# EAGLE design uBridge1.1 (EAGLE 6.6.0)
Assembly variants: PTH_60Vdc, PTH_36Vdc
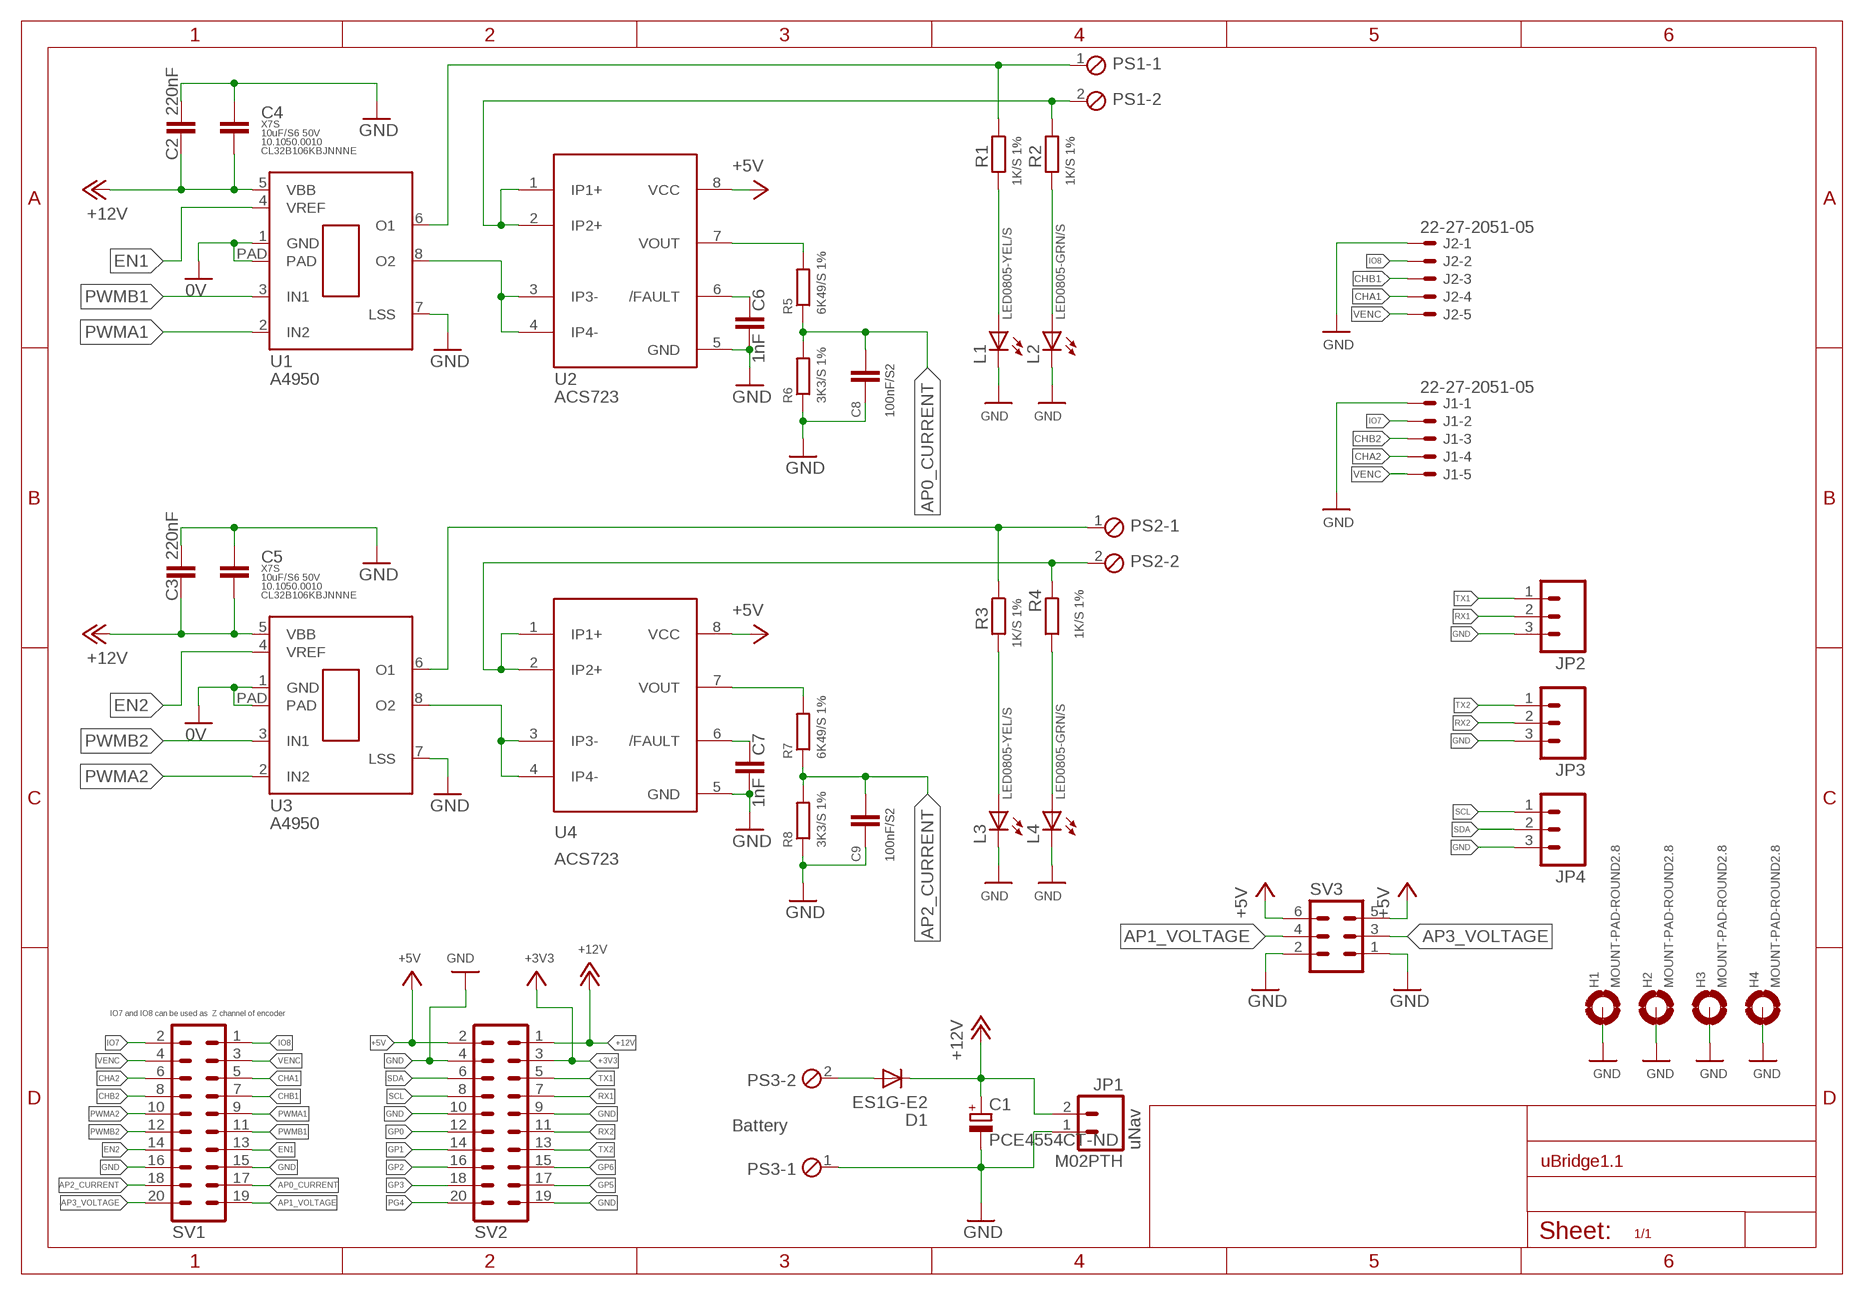
[diagram p0: schematic, sheet 1]

## Parts
C1  PCE4554CT-ND  CPOL-EUUD-6,3X7,7  [UD-6,3X7,7_NICHICON]
C2  220nF  C-EUC0805K  [C0805K]
C3  220nF  C-EUC0805K  [C0805K]
C4  10uF/S6 50V  C-EUC3225  [C3225]
C5  10uF/S6 50V  C-EUC3225  [C3225]
C6  1nF  C-EUC0805K  [C0805K]
C7  1nF  C-EUC0805K  [C0805K]
C8  100nF/S2  C-EUC0603  [C0603]
C9  100nF/S2  C-EUC0603  [C0603]
D1  ES1G-E2  DIODE-DO214BA  [DO214BA]  (not fitted in variant PTH_60Vdc)  (not fitted in variant PTH_36Vdc)
H1  MOUNT-PAD-ROUND2.8  [2,8-PAD]
H2  MOUNT-PAD-ROUND2.8  [2,8-PAD]
H3  MOUNT-PAD-ROUND2.8  [2,8-PAD]
H4  MOUNT-PAD-ROUND2.8  [2,8-PAD]
J1  22-27-2051-05  [6410-05]
J2  22-27-2051-05  [6410-05]
JP1  M02PTH  [1X02]
JP2  M03PTH  [1X03]
JP3  M03PTH  [1X03]
JP4  M03PTH  [1X03]
L1  LED0805-YEL/S  LEDCHIPLED_0805  [CHIPLED_0805]
L2  LED0805-GRN/S  LEDCHIPLED_0805  [CHIPLED_0805]
L3  LED0805-YEL/S  LEDCHIPLED_0805  [CHIPLED_0805]
L4  LED0805-GRN/S  LEDCHIPLED_0805  [CHIPLED_0805]
PS1  MPT2  [2POL254]
PS2  MPT2  [2POL254]
PS3  MPT2  [2POL254]
R1  1K/S 1%  R-EU_R0603  [R0603]
R2  1K/S 1%  R-EU_R0603  [R0603]
R3  1K/S 1%  R-EU_R0603  [R0603]
R4  1K/S 1%  R-EU_R0603  [R0603]
R5  6K49/S 1%  R-EU_R0603  [R0603]
R6  3K3/S 1%  R-EU_R0603  [R0603]
R7  6K49/S 1%  R-EU_R0603  [R0603]
R8  3K3/S 1%  R-EU_R0603  [R0603]
SV1  MA10-2  [MA10-2]
SV2  MA10-2  [MA10-2]
SV3  MA03-2  [MA03-2]
U1  A4950  [8SOICN]
U2  ACS723  ACS711  [SO08]
U3  A4950  [8SOICN]
U4  ACS723  ACS711  [SO08]

## Nets
+3V3: SV2.3
+5V: SV2.2 SV3.5 SV3.6 U2.8(VCC) U4.8(VCC)
+12V: C1.+ C2.2 C3.2 C4.2 C5.2 D1.C JP1.2 SV2.1 U1.5(VBB) U3.5(VBB)
AP0_CURRENT: C8.1 R5.1 R6.2 SV1.17
AP1_VOLTAGE: SV1.19 SV3.4
AP2_CURRENT: C9.1 R7.1 R8.2 SV1.18
AP3_VOLTAGE: SV1.20 SV3.3
CHA1: J2.4 SV1.5
CHA2: J1.4 SV1.6
CHB1: J2.3 SV1.7
CHB2: J1.3 SV1.8
EN1: SV1.13 U1.4(VREF)
EN2: SV1.14 U3.4(VREF)
GND: C1.- C2.1 C3.1 C4.1 C5.1 C6.2 C7.2 C8.2 C9.2 H1.B2,8(MOUNT) H2.B2,8(MOUNT) H3.B2,8(MOUNT) H4.B2,8(MOUNT) J1.1 J2.1 JP1.1 JP2.3 JP3.3 JP4.3 L1.C L2.C L3.C L4.C PS3.1 R6.1 R8.1 SV1.15 SV1.16 SV2.4 SV2.9 SV2.10 SV2.19 SV3.1 SV3.2 U1.1(GND) U1.7(LSS) U1.PAD U2.5(GND) U3.1(GND) U3.7(LSS) U3.PAD U4.5(GND) ; supply symbol labelled 0V
GP0: SV2.12
GP1: SV2.14
GP2: SV2.16
GP3: SV2.18
GP5: SV2.17
GP6: SV2.15
IO7: J1.2 SV1.2
IO8: J2.2 SV1.1
N$1: D1.A PS3.2
N$12: L1.A R1.2
N$13: L2.A R2.2
N$14: U1.8(O2) U2.3(IP3-) U2.4(IP4-)
N$18: R5.2 U2.7(VOUT)
N$19: U3.8(O2) U4.3(IP3-) U4.4(IP4-)
N$20: PS1.2 R2.1 U2.1(IP1+) U2.2(IP2+)
N$24: PS2.2 R4.1 U4.1(IP1+) U4.2(IP2+)
N$25: PS1.1 R1.1 U1.6(O1)
N$26: PS2.1 R3.1 U3.6(O1)
N$27: C6.1 U2.6(/FAULT)
N$28: C7.1 U4.6(/FAULT)
N$29: R7.2 U4.7(VOUT)
PG4: SV2.20
PWMA1: SV1.9 U1.2(IN2)
PWMA2: SV1.10 U3.2(IN2)
PWMB1: SV1.11 U1.3(IN1)
PWMB2: SV1.12 U3.3(IN1)
RX1: JP2.2 SV2.7
RX2: JP3.2 SV2.11
SCL: JP4.1 SV2.8
SDA: JP4.2 SV2.6
TX1: JP2.1 SV2.5
TX2: JP3.1 SV2.13
VENC: J1.5 J2.5 SV1.3 SV1.4
VENC1-LD3: L3.A R3.2
VENC2-LD4: L4.A R4.2

## Notes on the sheet
- IO7 and IO8 can be used as  Z channel of encoder
- Battery
- uNav

## Library data of the parts
C1 = rcl:CPOL-EU: POLARIZED CAPACITOR, European symbol
C2 C3 C6-C9 = rcl:C-EU: CAPACITOR, European symbol
C4 C5 = rcl:C-EU: CAPACITOR, European symbol; CASE: C3225 [EIA CC1210]; CODE: CL32B106KBJNNNE; KATODO: 10.1050.0010; TEMPERATURE: X7S
D1 = diode:DIODE-: DIODE
H1-H4 = holes:MOUNT-PAD-ROUND: MOUNTING PAD, round
J1 J2 = con-molex:22-?-05: CONNECTOR wire to board 2.54 mm (.1 inch) pitch header
JP1 = SparkFun-Connectors:M02: Standard 2-pin 0.1" header. Use with - straight break away headers ( PRT-00116) - right angle break away headers (PRT-00553) - swiss pins (PRT-00743) - machine pins (PRT-00117) - female headers (PRT-00115) Molex polarized connector foot print use with: PRT-08233 with associated crimp pins and housings. 2.54_SCREWTERM for use with PRT-10571. 3.5mm Screw Terminal footprints for PRT-08084 5mm Screw Terminal footprints for use with PRT-08433
JP2-JP4 = SparkFun-Connectors:M03: Header 3 Standard 3-pin 0.1" header. Use with straight break away headers (SKU : PRT-00116), right angle break away headers (PRT-00553), swiss pins (PRT-00743), machine pins (PRT-00117), and female headers (PRT-00115). Molex polarized connector foot print use with SKU : PRT-08232 with associated crimp pins and housings.
L1-L4 = led:LED: LED OSRAM: - CHIPLED LG R971, LG N971, LY N971, LG Q971, LY Q971, LO R971, LY R971 LH N974, LH R974 LS Q976, LO Q976, LY Q976 LO Q996 - Hyper CHIPLED LW Q18S LB Q993, LB Q99A, LB R99A - SideLED LS A670, LO A670, LY A670, LG A670, LP A670 LB A673, LV A673, LT A673, LW A673 LH A674 LY A675 LS A676, LA A676, LO A676, LY A676, LW A676 LS A679, LY A679, LG A679 - Hyper Micro SIDELED® LS Y876, LA Y876, LO Y876, LY Y876 LT Y87S - SmartLED LW L88C, LW L88S LB L89C, LB L89S, LG L890 LS L89K, LO L89K, LY L89K LS L896, LA L896, LO L896, LY L896 - TOPLED LS T670, LO T670, LY T670, LG T670, LP T670 LSG T670, LSP T670, LSY T670, LOP T670, LYG T670 LG T671, LOG T671, LSG T671 LB T673, LV T673, LT T673, LW T673 LH T674 LS T676, LA T676, LO T676, LY T676, LB T676, LH T676, LSB T676, LW T676 LB T67C, LV T67C, LT T67C, LS T67K, LO T67K, LY T67K, LW E67C LS E67B, LA E67B, LO E67B, LY E67B, LB E67C, LV E67C, LT E67C LW T67C LS T679, LY T679, LG T679 LS T770, LO T770, LY T770, LG T770, LP T770 LB T773, LV T773, LT T773, LW T773 LH T774 LS E675, LA E675, LY E675, LS T675 LS T776, LA T776, LO T776, LY T776, LB T776 LHGB T686 LT T68C, LB T68C - Hyper Mini TOPLED® LB M676 - Mini TOPLED Santana® LG M470 LS M47K, LO M47K, LY M47K Source: http://www.osram.convergy.de LUXEON: - LUMILED® LXK2-PW12-R00, LXK2-PW12-S00, LXK2-PW14-U00, LXK2-PW14-V00 LXK2-PM12-R00, LXK2-PM12-S00, LXK2-PM14-U00 LXK2-PE12-Q00, LXK2-PE12-R00, LXK2-PE12-S00, LXK2-PE14-T00, LXK2-PE14-U00 LXK2-PB12-K00, LXK2-PB12-L00, LXK2-PB12-M00, LXK2-PB14-N00, LXK2-PB14-P00, LXK2-PB14-Q00 LXK2-PR12-L00, LXK2-PR12-M00, LXK2-PR14-Q00, LXK2-PR14-R00 LXK2-PD12-Q00, LXK2-PD12-R00, LXK2-PD12-S00 LXK2-PH12-R00, LXK2-PH12-S00 LXK2-PL12-P00, LXK2-PL12-Q00, LXK2-PL12-R00 Source: www.luxeon.com KINGBRIGHT: KA-3528ASYC Source: www.kingbright.com
PS1-PS3 = Personale:MPT2: PHOENIX CONNECTOR
R1-R8 = rcl:R-EU_: RESISTOR, European symbol
SV1 SV2 = OfficineRobotiche:MA10-2: PIN HEADER; OC_FARNELL: unknown; OC_NEWARK: unknown
SV3 = con-lstb:MA03-2: PIN HEADER; OC_FARNELL: unknown; OC_NEWARK: unknown
U1 U3 = OfficineRobotiche:A4950
U2 U4 = OfficineRobotiche:ACS711

## Net classes
1 power: width 0.254 mm, drill 0.305 mm, clearance 0.203 mm

## Board
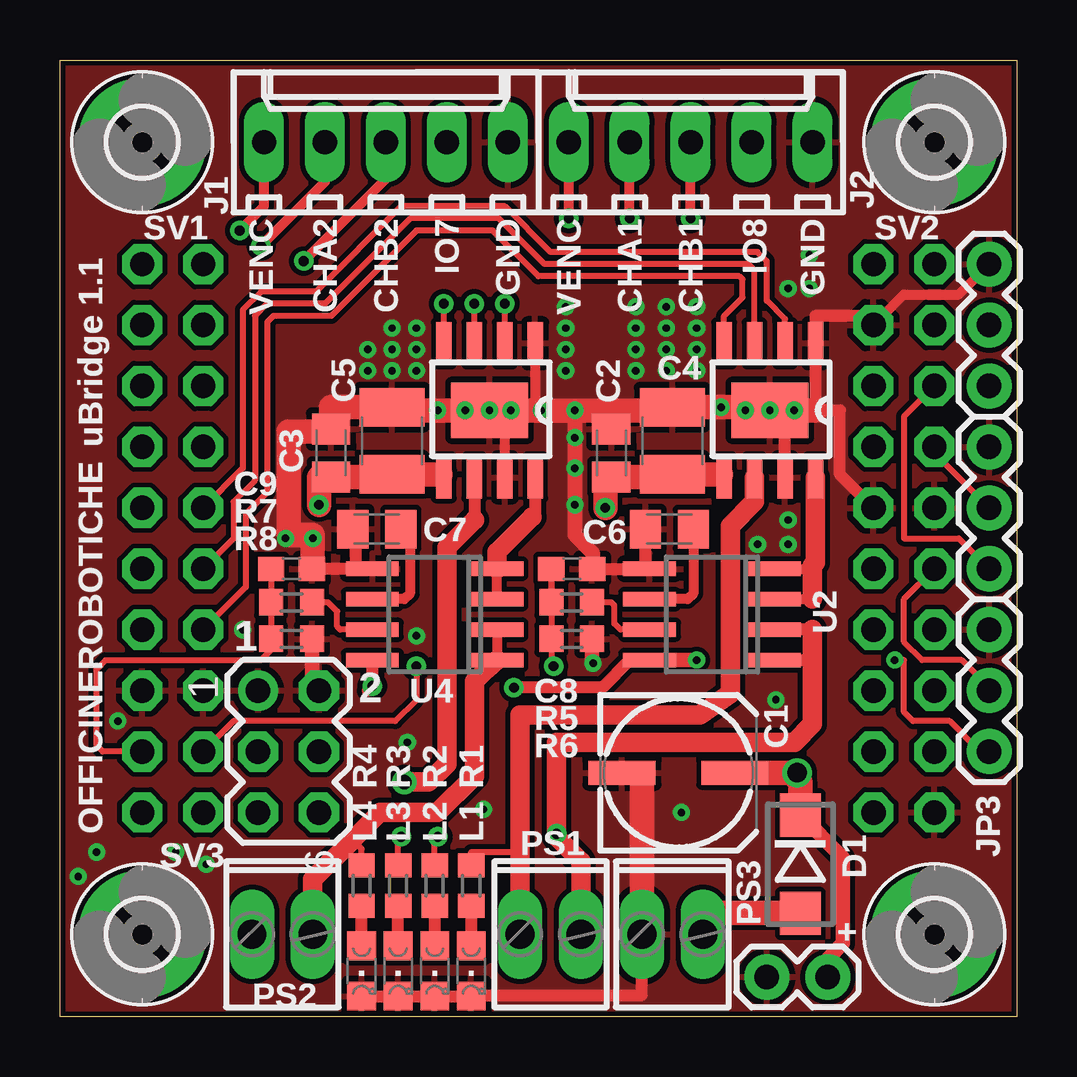
[diagram p1: board, top side]
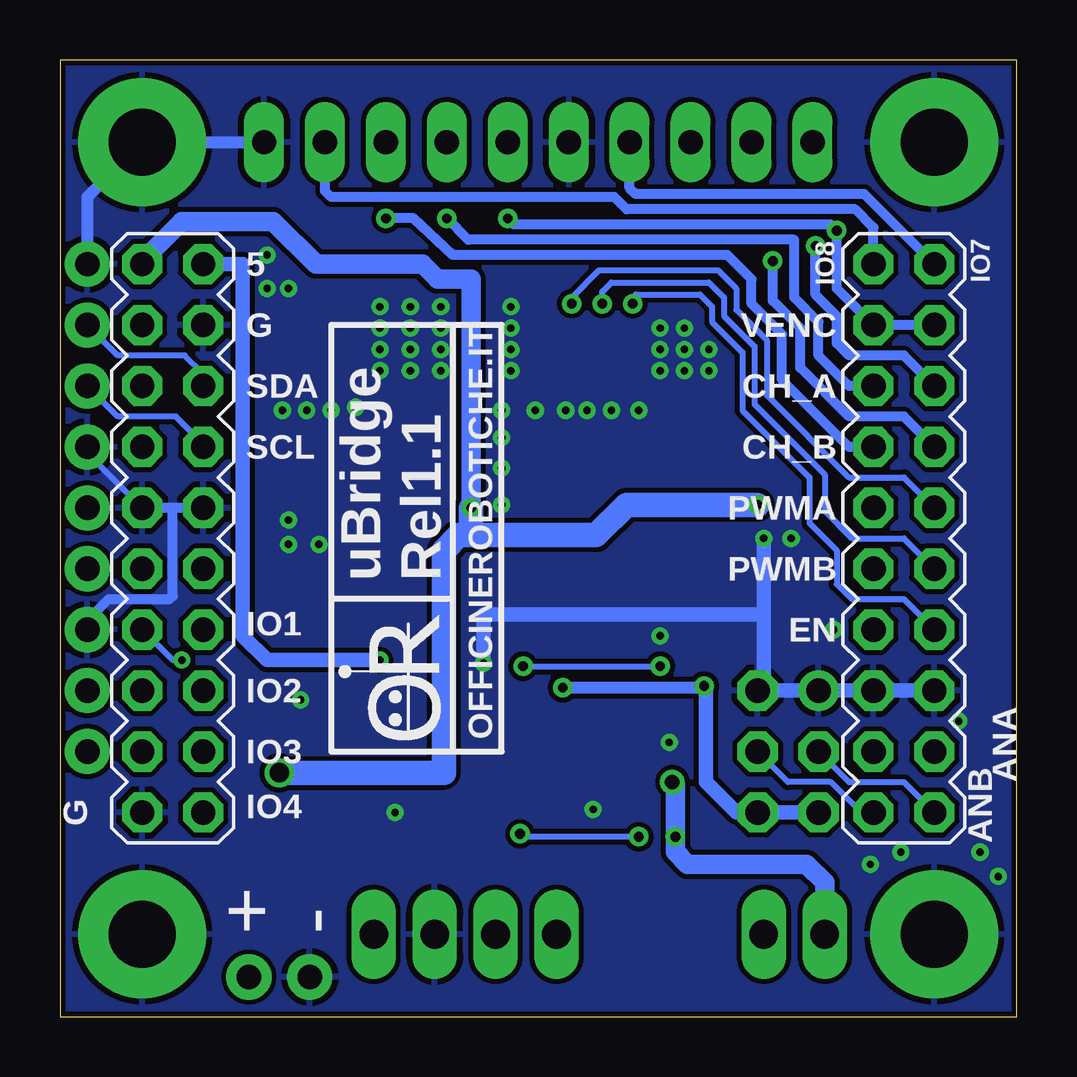
[diagram p2: board, bottom side, seen from below]

Size 39.88 x 39.88 mm. Coordinates in mm from the lower left corner, seen from the top.
Outline: 39.88,0 0,0 0,39.88 39.88,39.88 39.88,0
Copper layers (1*16): Top 0.035mm / dielectric 1.5mm / Bottom 0.035mm
Design rules "uNav44 *": minimum track width 8mil, minimum drill 12mil, track to track 8mil, track to pad 8mil, pad to pad 8mil, via to via 8mil, smd to smd 8mil, copper to edge 8mil, drill to drill 8mil, minimum pad ring 13mil, minimum via ring 8mil, stop-mask expansion 4mil, vias tented up to drill 24mil, thermal gap 10mil

### Footprints (pad centres in the part's own frame; a part is rotated, then mirrored left to right if it is on the bottom)
UD-6,3X7,7_NICHICON = smd 2.8 x 1: + 2.35,0; - -2.35,0
C0805K = smd 1.3 x 1.6: 1 -1,0; 2 1,0
C3225 = smd 1.6 x 2.7: 1 -1.4,0; 2 1.4,0
C0603 = smd 1.1 x 1: 1 -0.85,0; 2 0.85,0
DO214BA = smd 1.8 x 1.7: A 2.05,0; C -2.05,0
2,8-PAD = drill 2.8 pad 5.334: B2,8 0,0
6410-05 = drill 1.016 long: 1 5.08,0; 2 2.54,0; 3 0,0; 4 -2.54,0; 5 -5.08,0
1X02 = drill 1.016 pad 1.88: 1 0,0; 2 2.54,0
1X03 = drill 1.016 pad 1.88: 1 0,0; 2 2.54,0; 3 5.08,0
CHIPLED_0805 = smd 1.2 x 1.2: A 0,-1.05; C 0,1.05
2POL254 = drill 1.2 long: 1 -1.27,0; 2 1.27,0
R0603 = smd 1 x 1.1: 1 -0.85,0; 2 0.85,0
MA10-2 = drill 1.016 octagon: 1 -11.43,-1.27; 2 -11.43,1.27; 3 -8.89,-1.27; 4 -8.89,1.27; 5 -6.35,-1.27; 6 -6.35,1.27; 7 -3.81,-1.27; 8 -3.81,1.27; 9 -1.27,-1.27; 10 -1.27,1.27; 11 1.27,-1.27; 12 1.27,1.27; 13 3.81,-1.27; 14 3.81,1.27; 15 6.35,-1.27; 16 6.35,1.27; 17 8.89,-1.27; 18 8.89,1.27; 19 11.43,-1.27; 20 11.43,1.27
MA03-2 = drill 1.016: 1 -2.54,-1.27 | drill 1.016 octagon: 2 -2.54,1.27; 3 0,-1.27; 4 0,1.27; 5 2.54,-1.27; 6 2.54,1.27
8SOICN = smd 0.65 x 1.75: 1 -1.905,-2.8; 2 -0.635,-2.8; 3 0.635,-2.8; 4 1.905,-2.8; 5 1.905,2.8; 6 0.635,2.8; 7 -0.635,2.8; 8 -1.905,2.8 | smd 3.2 x 2.3: PAD 0,0
SO08 = smd 0.6 x 2.2: 1 -1.905,-2.6; 2 -0.635,-2.6; 3 0.635,-2.6; 4 1.905,-2.6; 5 1.905,2.6; 6 0.635,2.6; 7 -0.635,2.6; 8 -1.905,2.6

### Placement (x,y rotation side)
C1  25.78,10.16 0 top
C2  22.99,23.49 270 top
C3  11.3,23.49 270 top
C4  25.53,24 270 top
C5  13.84,24 270 top
C6  25.4,20.32 180 top
C7  13.21,20.32 180 top
C8  21.34,18.67 0 top
C9  9.65,18.67 0 top
D1  30.86,6.35 270 top
H1  3.43,3.43 0 top
H2  36.45,3.43 0 top
H3  36.45,36.45 0 top
H4  3.43,36.45 0 top
J1  13.59,36.45 0 top
J2  26.29,36.45 0 top
JP1  29.46,1.65 0 top
JP2  38.73,18.67 90 top
JP3  38.73,11.05 90 top
JP4  38.73,26.29 90 top
L1  17.14,1.9 180 top
L2  15.62,1.9 180 top
L3  14.1,1.9 180 top
L4  12.57,1.9 180 top
PS1  20.45,3.43 0 top
PS2  9.27,3.43 0 top
PS3  25.53,3.43 0 top
R1  17.14,5.46 270 top
R2  15.62,5.46 270 top
R3  14.1,5.46 270 top
R4  12.57,5.46 270 top
R5  21.34,17.27 0 top
R6  21.34,15.75 180 top
R7  9.65,17.27 0 top
R8  9.65,15.75 180 top
SV1  4.7,19.94 270 bottom
SV2  35.18,19.94 270 bottom
SV3  9.53,11.05 270 top
U1  29.59,25.27 180 top
U2  27.18,16.76 90 top
U3  17.91,25.27 180 top
U4  15.62,16.76 90 top

### Tracks (layer width: path | path; a pad name or v marks a point on that pad's centre or on a via)
+5V  (via drill 0.3, 0.41)
  Top 0.508: 12.83,13.59 v13.02,13.78 U4.8 | U2.8 23.75,14.86 22.61,13.72 v18.92,13.72
  Top 0.61: v26.54,14.86 U2.8
  Bottom 0.508: v18.92,13.72 13.09,13.72 v13.02,13.78
  Bottom 0.61: SV2.2 32.26,31.37 32.26,15.88 31.24,14.86 v26.54,14.86 | SV3.6 SV3.5 11.68,8.51 12.95,9.78 12.95,13.72 v13.02,13.78
+12V  (via drill 0.41, 0.81)
  Top 0.61: JP1.2 32,2.41 32.64,3.05 32.64,6.62 D1.C | 13.73,22.49 C5.2 | 15.87,22.6 U3.5 | 25.42,22.49 C4.2 | 27.56,22.6 U1.5 | 22.97,22.48 C2.2
  Top 1.016: D1.C 30.86,9.78 30.48,10.16 C1.+ v30.73,10.16 | 13.73,22.49 C3.2 11.29,22.48 10.79,22.48 v10.79,21.34 | C5.2 15.87,22.6 | C2.2 25.42,22.49 | C4.2 27.56,22.6 | v22.73,21.21 22.73,22.35 22.86,22.48 22.97,22.48
  Bottom 0.813: SV2.1 36.45,31.5 34.8,33.15 30.99,33.15 29.21,31.37 24.76,31.37 24.13,30.73 22.73,30.73 v22.73,21.21
  Bottom 1.016: v10.79,21.34 16.26,21.34 17.53,20.07 22.73,20.07 | 22.73,20.07 v22.73,21.21 | v30.73,10.16 23.88,10.16 23.88,19.43 23.24,20.07 22.73,20.07
AP0_CURRENT  (via drill 0.41)
  Top 0.254: R5.1 C8.1 R6.2 20.49,14.69 v20.57,14.61 | v14.86,14.61 14.86,13.21 13.97,12.32 7.24,12.32 SV1.17
  Bottom 0.254: v20.57,14.61 v14.86,14.61
AP1_VOLTAGE
  Bottom 0.254: SV1.19 6.48,8.51 7.75,9.78 9.53,9.78 SV3.4
AP2_CURRENT
  Top 0.254: 3.56,11.05 SV1.18 1.78,11.05 1.52,11.3 1.52,14.48 1.9,14.86 8.38,14.86 8.8,15.28 R8.2 C9.1 R7.1
AP3_VOLTAGE
  Bottom 0.254: SV3.3 6.98,9.78 4.7,9.78 SV1.20
CHA1  (via drill 0.41)
  Top 0.406: v23.75,33.27 J2.4
  Bottom 0.406: SV1.5 6.98,26.29 8.25,27.56 8.25,28.96 9.27,29.97 9.27,32.38 22.86,32.38 v23.75,33.27
CHA2  (via drill 0.41)
  Top 0.406: v8.38,32.13 11.05,34.8 J1.4
  Bottom 0.406: SV1.6 4.7,27.56 6.98,27.56 7.49,28.07 7.49,29.21 8.38,30.1 v8.38,32.13
CHB1  (via drill 0.41)
  Top 0.406: v26.29,33.27 J2.3
  Bottom 0.406: SV1.7 6.98,23.75 9.78,26.54 9.78,28.45 11.05,29.72 11.05,30.73 12.06,31.75 23.49,31.75 25.15,33.27 v26.29,33.27
CHB2  (via drill 0.41)
  Top 0.406: v10.16,31.5 13.59,34.92 J1.3
  Bottom 0.406: SV1.8 4.7,25.02 6.98,25.02 9.02,27.05 9.02,27.81 9.02,28.7 10.16,29.84 v10.16,31.5
EN1
  Top 0.254: U1.4 27.69,29.21 28.45,29.97 28.45,30.73 28.32,30.86 19.94,30.86 18.03,32.77 14.86,32.77 11.3,29.21 8.89,29.21 8.64,28.96 8.64,21.84 7.75,20.95 7.75,17.91 SV1.13
EN2  (via drill 0.41)
  Top 0.254: U3.4 v16,29.72
  Bottom 0.254: v16,29.72 16,29.97 15.88,30.1 13.21,30.1 12.7,29.59 12.7,28.96 11.43,27.69 11.43,25.27 8.64,22.48 8.64,20.57 7.49,19.43 7.49,18.03 6.86,17.4 4.7,17.4 SV1.14
GND  (via drill 0.3)
  Top 0.406: SV2.4 35.18,30.1 37.47,30.1 JP4.3 | U3.1 19.81,25.27 v18.8,25.27 | U3.7 18.54,25.27
  Top 0.508: U1.7 30.23,25.27 | SV2.4 33.53,29.21 31.5,29.21 U1.1 31.5,25.27 32.51,25.27 32.51,22.61 SV2.10 | C4.1 25.4,25.27 | C8.2 U2.5 24.4,18.85 C6.2 | U4.5 12.32,18.67 | 12.32,18.67 10.54,18.67 | C7.2 12.32,20.21 12.32,18.67 | L4.C L3.C L2.C L1.C 17.18,0.89 24.26,0.89 PS3.1
  Top 0.61: v21.46,25.27 21.46,20.07 22.22,19.3 22.22,18.67 C8.2 | R6.1 22.19,14.73 v22.22,14.73 | R8.1 10.5,13.88 SV3.2
  Top 1.016: 31.5,25.27 30.23,25.27 U1.PAD 29.46,25.4 C4.1 | 25.4,25.27 22.99,25.27 | PS3.1 24.26,10.16 C1.- | C9.2 10.54,18.67 v10.54,19.94 10.54,20.07 9.53,20.07 9.53,24.38 11.3,24.38 C3.1 11.3,25.4 C5.1 13.84,25.27 U3.PAD 18.54,25.27 v18.8,25.27 v21.46,25.27 22.99,25.27 | C2.1 22.99,25.27
  Bottom 0.254: JP2.3 38.73,23.49 SV2.9
  Bottom 0.406: JP3.3 38.73,16.51 37.85,17.4 35.31,17.4 35.18,17.53 35.18,21.08 35.05,21.21 | 35.05,21.21 SV2.9 | SV2.10 35.05,21.21
  Bottom 0.508: JP4.3 38.73,34.16 H3.B2,8 J2.1
  Bottom 0.61: SV1.16 SV1.15 SV3.1 SV3.2 10.54,13.84 10.54,16.76 | v10.54,19.94 10.54,16.76 | v22.22,14.73 22.22,16.76 10.54,16.76
  other vias: 17.65,8.64 25.91,8.51 29.84,13.21 21.46,21.34 21.46,22.86 21.46,24.13 21.08,26.92 21.08,27.81 21.08,28.7 29.59,25.27 28.57,25.27 30.61,25.27 17.91,25.27 16.89,25.27 13.84,26.92 15.75,25.27 27.56,25.4 25.27,26.92 25.27,29.59 25.27,28.7 13.84,27.81 13.84,28.7 24,26.92 26.54,26.92 26.54,27.81 26.54,28.7 26.54,29.59 24,27.81 24,28.7 25.27,27.81 21.08,29.59 31.24,30.35 31.24,31.75 29.08,19.68 30.35,19.68 30.35,20.7 14.86,15.88 14.48,11.43 6.1,6.35 4.83,6.86 1.52,6.86 0.76,5.84 2.41,12.32 7.62,16.13 9.4,19.94 14.86,26.92 14.86,27.81 14.86,28.7 12.83,26.92 12.83,27.81 20.07,25.27 30.35,30.35 24,29.59
  pour Top (isolate 0.203): 0,39.88 0,0 39.88,0 39.88,39.88
  pour Bottom (isolate 0.203): 0,39.88 0,0 39.88,0 39.88,39.88
IO7
  Bottom 0.406: SV1.2 6.35,34.29 15.88,34.29 16.13,34.54 J1.2
IO8
  Bottom 0.406: SV1.1 5.97,32.89 6.73,33.66 16.26,33.66 16.76,34.16 28.57,34.16 28.83,34.42 J2.2
N$1
  Top 0.508: 30.84,4.32 D1.A
  Top 1.016: PS3.2 26.8,3.68 27.43,4.32 30.84,4.32
N$12
  Top 0.508: R1.2 L1.A
N$13
  Top 0.508: R2.2 L2.A
N$14
  Top 0.406: U2.3 31.37,17.4 | U2.4 31.37,18.67
  Top 0.813: 31.37,17.4 31.37,18.67 31.37,18.8 31.5,18.92 U1.8
N$18
  Top 0.254: U2.7 23.37,16.13 23.11,16.38 23.11,17.14 22.99,17.27 R5.2
N$19
  Top 0.406: U4.3 U4.4
  Top 0.508: U3.8 19.81,20.95 19.68,20.83
  Top 0.813: U4.4 18.22,19.36 19.68,20.83
N$20  (via drill 0.41)
  Top 0.254: R2.1 15.62,7.37 v15.75,7.49
  Top 0.508: 31.37,16.13 U2.2 | U2.1 31.37,14.86
  Top 0.813: PS1.2 21.72,6.48 20.7,7.49 v20.7,7.62 20.7,11.43 30.61,11.43 31.37,12.19 31.37,14.86 31.37,16.13
  Bottom 0.254: v15.75,7.49 20.57,7.49 v20.7,7.62
N$24
  Top 0.254: R4.1 12.57,6.98 12.19,7.37
  Top 0.406: U4.2 U4.1
  Top 0.813: PS2.2 10.54,5.71 12.19,7.37 13.34,8.51 15.75,8.51 17.27,10.03 17.27,13.97 17.78,14.48 U4.1
N$25
  Top 0.254: R1.1 17.14,6.86 19.18,6.86
  Top 0.813: PS1.1 19.18,6.86 19.18,12.57 26.67,12.57 27.94,13.46 27.94,20.45 28.96,21.46 U1.6
N$26  (via drill 0.41, 0.61)
  Top 0.254: R3.1 14.1,7.37 v14.22,7.49
  Top 0.508: U3.6 17.27,20.7
  Top 0.813: v14.35,9.78 15.37,9.78 16.13,10.54 16.13,19.56 17.27,20.7
  Bottom 0.813: PS2.1 8,5.59 8.76,6.35 13.72,6.35 14.22,6.86 v14.22,7.49 14.22,9.65 v14.35,9.78
N$27
  Top 0.406: C6.1 26.4,17.64 26.16,17.4 U2.6
N$28
  Top 0.406: C7.1 14.35,20.32 14.59,20.08 14.59,17.64 14.35,17.4 U4.6
N$29
  Top 0.254: U4.7 11.68,16.13 11.56,16.26 11.56,16.89 11.18,17.27 R7.2
PWMA1
  Top 0.254: U1.2 30.23,29.08 29.46,29.84 29.46,31.5 29.08,31.88 20.45,31.88 18.54,33.78 14.22,33.78 10.67,30.23 8.38,30.23 7.62,29.46 7.62,22.86 SV1.9
PWMA2  (via drill 0.41)
  Top 0.254: U3.2 v18.54,29.72
  Bottom 0.254: v18.54,29.72 18.54,29.97 17.4,31.11 12.45,31.11 11.68,30.35 11.68,29.46 10.41,28.19 10.41,25.91 6.98,22.48 4.7,22.48 SV1.10
PWMB1
  Top 0.254: U1.3 28.96,31.11 28.7,31.37 20.19,31.37 18.29,33.27 14.61,33.27 11.05,29.72 8.64,29.72 8.13,29.21 8.13,22.35 7.24,21.46 7.24,19.94 SV1.11
PWMB2  (via drill 0.41)
  Top 0.254: U3.3 v17.27,29.72
  Bottom 0.254: v17.27,29.72 17.27,30.23 16.89,30.61 12.83,30.61 12.19,29.97 12.19,29.21 10.92,27.94 10.92,25.53 8,22.61 8,21.08 6.86,19.94 4.7,19.94 SV1.12
RX1
  Top 0.254: SV2.7 36.45,23.49 JP2.2
RX2
  Top 0.254: JP3.2 38.73,13.72 37.59,14.86 35.94,14.86 35.18,15.62 35.18,17.4 SV2.11
SCL
  Bottom 0.254: SV2.8 33.91,23.88 35.05,25.02 37.47,25.02 JP4.1
SDA
  Bottom 0.254: SV2.6 33.91,26.8 34.67,27.56 37.47,27.56 JP4.2
TX1
  Top 0.254: JP2.1 37.47,19.94 35.18,19.94 35.18,25.02 SV2.5
TX2  (via drill 0.3)
  Top 0.254: JP3.1 38.35,11.05 37.08,12.32 35.56,12.32 35.18,12.7 35.18,14.86 v34.8,14.86
  Bottom 0.254: v34.8,14.86 35.18,14.86 SV2.13
VENC  (via drill 0.41)
  Top 0.406: v21.21,33.27 J2.5 | v7.49,32.77 8.51,33.78 J1.5
  Bottom 0.406: SV1.4 SV1.3 7.49,30.35 v7.49,32.77 7.75,33.02 20.95,33.02 v21.21,33.27
VENC1-LD3
  Top 0.508: L3.A R3.2
VENC2-LD4
  Top 0.508: L4.A R4.2

### Text on the board
tPlace: VENC | CHA2 | CHB2 | IO7 | GND | VENC | CHA1 | CHB1 | IO8 | GND | uBridge 1.1 | OFFICINEROBOTICHE
bPlace: IO7 | 5 | IO8 | VENC | G | CH_A | SDA | CH_B | SCL | PWMA | PWMB | uBridge / Rel1.1 | EN | IO1 | IO2 | OFFICINEROBOTICHE.IT | IO3 | ANA | IO4 | G | ANB | - | +
tNames: +
_tsilk: J1 | VENC | CHA2 | CHB2 | IO7 | GND | VENC | CHA1 | CHB1 | IO8 | GND | J2 | SV1 | SV2 | C5 | C2 | C4 | C3 | uBridge 1.1 | C9 | R7 | C6 | R8 | C7 | U2 | 1 | U4 | C8 | 2 | R5 | R6 | C1 | R4 | R3 | R2 | R1 | L4 | L3 | L2 | L1 | OFFICINEROBOTICHE | SV3 | D1 | PS1 | JP3 | PS3 | + | PS2
_bsilk: IO7 | 5 | IO8 | VENC | G | CH_A | SDA | CH_B | SCL | PWMA | PWMB | uBridge / Rel1.1 | EN | IO1 | IO2 | OFFICINEROBOTICHE.IT | IO3 | ANA | IO4 | G | ANB | - | +